# Altium schematic sheet 04.SchDoc
size 297 x 209 mm
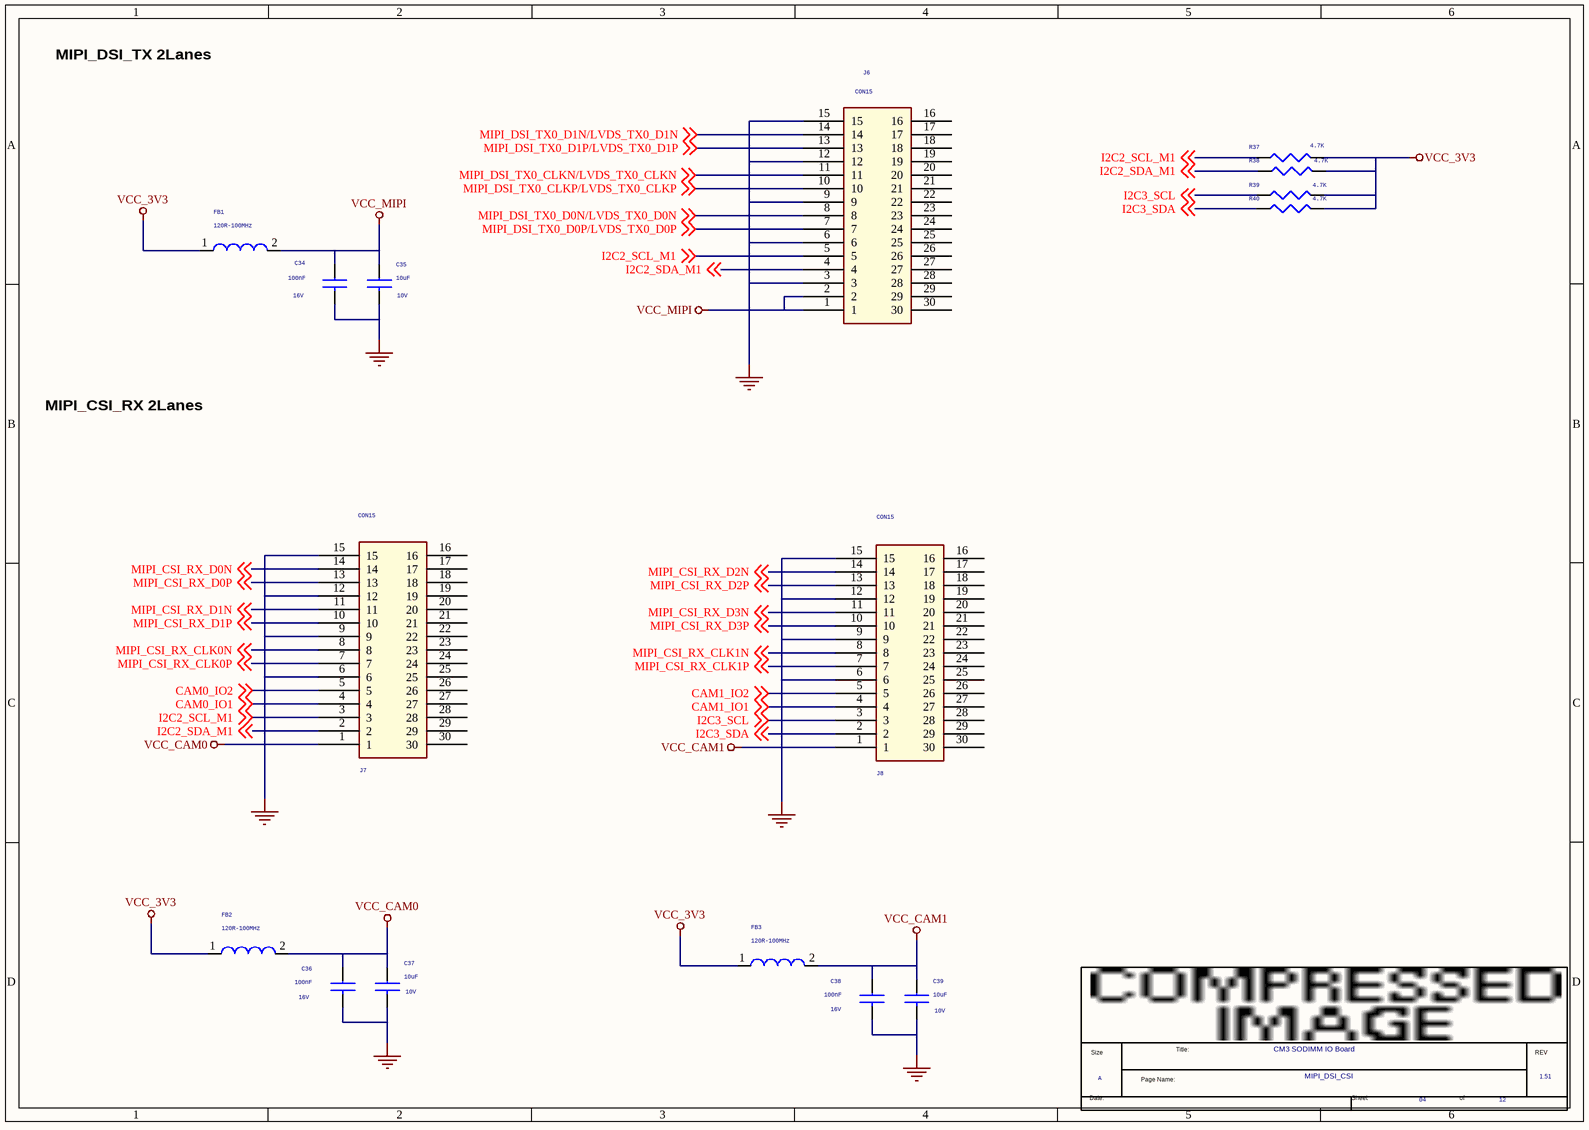
[diagram p0: 04.SchDoc]

## Parts
*  Page Count: 12  Page Number: 04  Page Size: A  Title: CM3 SODIMM IO Board  RevCode: 1.51  Doc: MIPI_DSI_CSI  (hidden comment: radxa_1010)  (graphical)
C34  100nF  Voltage: 16V  [C0402]
C35  10uF  Voltage: 10V  [C0603]
C36  100nF  Voltage: 16V  [C0402]
C37  10uF  Voltage: 10V  [C0603]
C38  100nF  Voltage: 16V  [C0402]
C39  10uF  Voltage: 10V  [C0603]
FB1  120R-100MHz  [L0402]
FB2  120R-100MHz  [L0402]
FB3  120R-100MHz  [L0402]
J6  CON15  [FPC15PIN-1.0MM-LS]
J7  CON15  [FPC15PIN-1.0MM-LS]
J8  CON15  [FPC15PIN-1.0MM-LS]
R37  4.7K  [R0402]
R38  4.7K  [R0402]
R39  4.7K  [R0402]
R40  4.7K  [R0402]

## Nets
GND: C34.2 C35.2 C36.2 C37.2 C38.2 C39.2 J6.3 J6.6 J6.9 J6.12 J6.15 J7.6 J7.9 J7.12 J7.15 J8.6 J8.9 J8.12 J8.15
VCC_3V3: FB1.1 FB2.1 FB3.1 R37.2 R38.2 R39.2 R40.2
VCC_CAM0: C36.1 C37.1 FB2.2 J7.1
VCC_CAM1: C38.1 C39.1 FB3.2 J8.1
VCC_MIPI: C34.1 C35.1 FB1.2 J6.1 J6.2
CAM0_IO1: J7.4 ; off-sheet CAM0_IO1
CAM0_IO2: J7.5 ; off-sheet CAM0_IO2
CAM1_IO1: J8.4 ; off-sheet CAM1_IO1
CAM1_IO2: J8.5 ; off-sheet CAM1_IO2
I2C2_SCL_M1: J6.5 J7.3 R37.1 ; off-sheet I2C2_SCL_M1
I2C2_SDA_M1: J6.4 J7.2 R38.1 ; off-sheet I2C2_SDA_M1
I2C3_SCL: J8.3 R39.1 ; off-sheet I2C3_SCL
I2C3_SDA: J8.2 R40.1 ; off-sheet I2C3_SDA
MIPI_CSI_RX_CLK0N: J7.8 ; off-sheet MIPI_CSI_RX_CLK0N
MIPI_CSI_RX_CLK0P: J7.7 ; off-sheet MIPI_CSI_RX_CLK0P
MIPI_CSI_RX_CLK1N: J8.8 ; off-sheet MIPI_CSI_RX_CLK1N
MIPI_CSI_RX_CLK1P: J8.7 ; off-sheet MIPI_CSI_RX_CLK1P
MIPI_CSI_RX_D0N: J7.14 ; off-sheet MIPI_CSI_RX_D0N
MIPI_CSI_RX_D0P: J7.13 ; off-sheet MIPI_CSI_RX_D0P
MIPI_CSI_RX_D1N: J7.11 ; off-sheet MIPI_CSI_RX_D1N
MIPI_CSI_RX_D1P: J7.10 ; off-sheet MIPI_CSI_RX_D1P
MIPI_CSI_RX_D2N: J8.14 ; off-sheet MIPI_CSI_RX_D2N
MIPI_CSI_RX_D2P: J8.13 ; off-sheet MIPI_CSI_RX_D2P
MIPI_CSI_RX_D3N: J8.11 ; off-sheet MIPI_CSI_RX_D3N
MIPI_CSI_RX_D3P: J8.10 ; off-sheet MIPI_CSI_RX_D3P
MIPI_DSI_TX0_CLKN/LVDS_TX0_CLKN: J6.11 ; off-sheet MIPI_DSI_TX0_CLKN/LVDS_TX0_CLKN
MIPI_DSI_TX0_CLKP/LVDS_TX0_CLKP: J6.10 ; off-sheet MIPI_DSI_TX0_CLKP/LVDS_TX0_CLKP
MIPI_DSI_TX0_D0N/LVDS_TX0_D0N: J6.8 ; off-sheet MIPI_DSI_TX0_D0N/LVDS_TX0_D0N
MIPI_DSI_TX0_D0P/LVDS_TX0_D0P: J6.7 ; off-sheet MIPI_DSI_TX0_D0P/LVDS_TX0_D0P
MIPI_DSI_TX0_D1N/LVDS_TX0_D1N: J6.14 ; off-sheet MIPI_DSI_TX0_D1N/LVDS_TX0_D1N
MIPI_DSI_TX0_D1P/LVDS_TX0_D1P: J6.13 ; off-sheet MIPI_DSI_TX0_D1P/LVDS_TX0_D1P

Not connected (* = marked no-connect by the designer): J6 16 17 18 19 20 21 22 23 24 25 26 27 28 29 30; J7 16 17 18 19 20 21 22 23 24 25 26 27 28 29 30; J8 16 17 18 19 20 21 22 23 24 25 26 27 28 29 30

## Notes on the sheet
- MIPI_DSI_TX 2Lanes
- MIPI_CSI_RX 2Lanes
- (in symbol radxa_1010) Title:; Size; REV; Page Name:; Date:; Sheet; of

## Library data of the parts
C34 C38 = CAP NP_0_Dup2: cap,100.00nF,+/-10%,16V,X5R,C0402; Manufacturer PN: C1005X5R1C104K050BA; Manufacturer: TDK; Tolerance: 10%; Priority: A; Dielectric: X5R; Created by: JJJ; Part Type: C0402; RK PN: C1005X5R1C104K050BA
C35 C37 = CAP NP_0: cap,10.00uF,+/-10%,10V,X5R,C0805; Manufacturer: TDK; RK PN: C2012X5R1A106K125AB; Priority: A; Tolerance: 10%; Dielectric: X5R; Part Type: C0805; Manufacturer PN: C2012X5R1A106K125AB; Created by: JJJ
C36 = CAP NP_0_Dup2: cap,100.00nF,+/-10%,16V,X5R,C0402; Manufacturer: TDK; RK PN: C1005X5R1C104K050BA; Priority: A; Tolerance: 10%; Dielectric: X5R; Part Type: C0402; Manufacturer PN: C1005X5R1C104K050BA; Created by: JJJ
C39 = CAP NP_0: cap,10.00uF,+/-10%,10V,X5R,C0805; Manufacturer PN: C2012X5R1A106K125AB; Manufacturer: TDK; Tolerance: 10%; Priority: A; Dielectric: X5R; Created by: JJJ; Part Type: C0805; RK PN: C2012X5R1A106K125AB
FB1 FB2 = BEAD: BEAD,120R@100MHz,current=2000mA,0603; Manufacturer PN: BLM18KG121TN1; Manufacturer: Murata; Irms: 2A; Tolerance: 25%; DC Resistor: 0.030ohm; Priority: L; Created by: DZS; Part Type: BEAD; RK PN: BLM18KG121TN1
FB3 = BEAD: BEAD,120R@100MHz,current=2000mA,0603; Manufacturer: Murata; Irms: 2A; Tolerance: 25%; DC Resistor: 0.030ohm; RK PN: BLM18KG121TN1; Priority: L; Part Type: BEAD; Manufacturer PN: BLM18KG121TN1; Created by: DZS
J6 = CON15_4
J7 J8 = CON15_5
R37 R39 R40 = RESISTOR_0: 通用厚膜电阻,0R,+/-5%,R0402,1/16W.; Manufacturer: YAGEO; Tolerance: 5%; RK PN: RC0402JR-070RL; Priority: A; Wattage: 1/16W; Option: DNP; Part Type: 通用厚膜电阻; Manufacturer PN: RC0402JR-070RL; Created by: YTL
R38 = RESISTOR_0: 通用厚膜电阻,0R,+/-5%,R0402,1/16W.; Manufacturer PN: RC0402JR-070RL; Manufacturer: YAGEO; Tolerance: 5%; Option: DNP; Wattage: 1/16W; Priority: A; Created by: YTL; Part Type: 通用厚膜电阻; RK PN: RC0402JR-070RL
* = radxa_1010: Page Create Date: March  8, 1995